# Altium schematic sheet DX-BT24-T_SCH_Part_AD.SchDoc
size A4
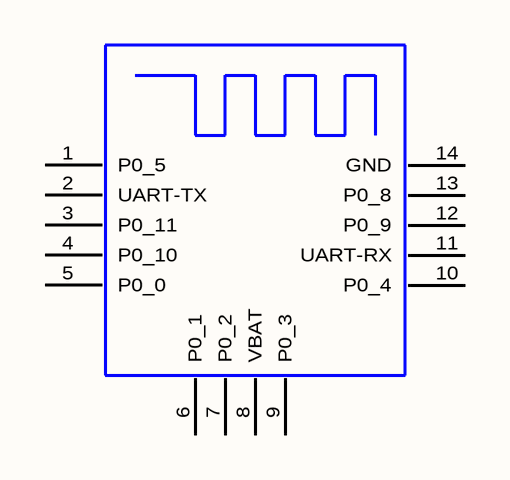
[diagram p0: DX-BT24-T_SCH_Part_AD.SchDoc]

## Parts
U??  DX-BT24-T  [DX-BT24-T]  (value not drawn)

## Nets

Not connected (* = marked no-connect by the designer): U?? 1(P0_5) 2(UART-TX) 3(P0_11) 4(P0_10) 5(P0_0) 6(P0_1) 7(P0_2) 8(VBAT) 9(P0_3) 10(P0_4) 11(UART-RX) 12(P0_9) 13(P0_8) 14(GND)

## Library data of the parts
U?? = DX-BT24-T: PCB DECAL: DX-BT24-S